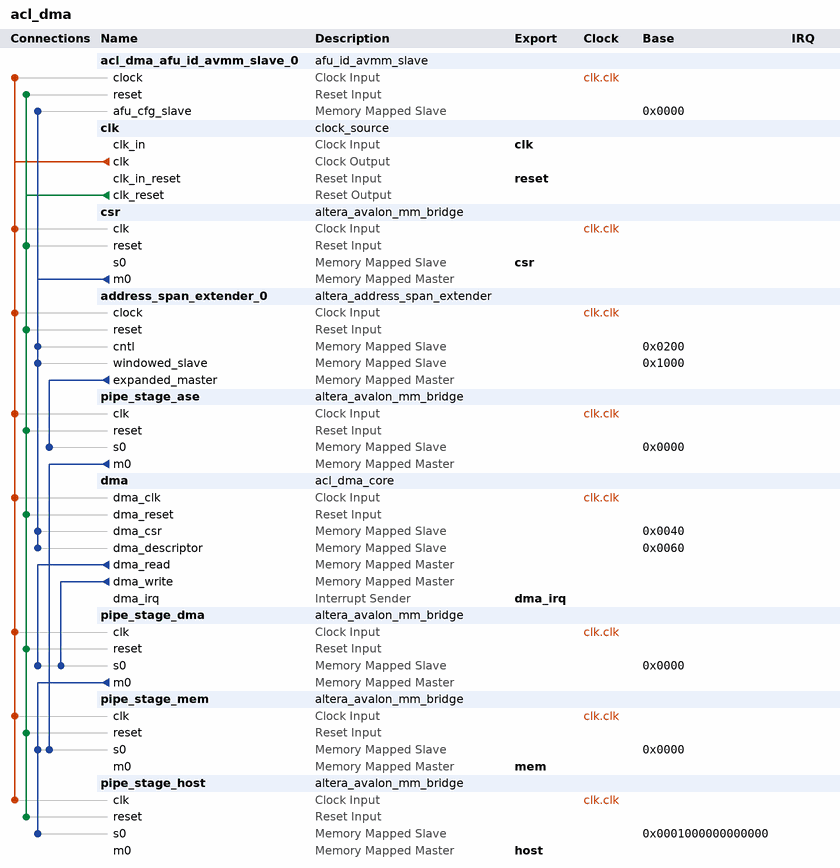
[diagram p0: system contents]
# Platform Designer (Qsys) system acl_dma, Arria 10 10AX115N3F40E2SG
# Parameters at their usual value, and those the tool derives, are not listed.
package require -exact qsys 1.0
create_system acl_dma
set_project_property DEVICE_FAMILY {Arria 10}
set_project_property DEVICE 10AX115N3F40E2SG

add_component acl_dma_afu_id_avmm_slave_0 ip/acl_dma/acl_dma_afu_id_avmm_slave_0.ip afu_id_avmm_slave acl_dma_afu_id_avmm_slave_0 1.0
load_component acl_dma_afu_id_avmm_slave_0
set_component_parameter_value AFU_ID_H 15536303038640245953
set_component_parameter_value AFU_ID_L 10730808499136109731
set_component_parameter_value DFH_FEATURE_TYPE 2
set_component_parameter_value DFH_AFU_MINOR_REV 0
set_component_parameter_value DFH_AFU_MAJOR_REV 0
set_component_parameter_value DFH_END_OF_LIST 1
set_component_parameter_value DFH_NEXT_OFFSET 8192
set_component_parameter_value DFH_FEATURE_ID 0
set_component_parameter_value NEXT_AFU_OFFSET 0
set_component_parameter_value CREATE_SCRATCH_REG 0
save_component

add_component clk ip/acl_dma/acl_dma_clk.ip clock_source clk 
load_component clk
set_component_parameter_value clockFrequency 100000000
set_component_parameter_value resetSynchronousEdges DEASSERT
save_component

add_component csr ip/acl_dma/acl_dma_csr.ip altera_avalon_mm_bridge csr 17.0
load_component csr
set_component_parameter_value DATA_WIDTH 64
set_component_parameter_value ADDRESS_WIDTH 13
set_component_parameter_value USE_AUTO_ADDRESS_WIDTH 0
set_component_parameter_value ADDRESS_UNITS SYMBOLS
set_component_parameter_value MAX_PENDING_RESPONSES 1
save_component

add_component address_span_extender_0 ip/acl_dma/acl_dma_address_span_extender_0.ip altera_address_span_extender address_span_extender_0 17.0
load_component address_span_extender_0
set_component_parameter_value DATA_WIDTH 512
set_component_parameter_value MASTER_ADDRESS_WIDTH 48
set_component_parameter_value SLAVE_ADDRESS_WIDTH 6
set_component_parameter_value BURSTCOUNT_WIDTH 1
set_component_parameter_value MASTER_ADDRESS_DEF 0
set_component_parameter_value ENABLE_SLAVE_PORT true
set_component_parameter_value MAX_PENDING_READS 16
save_component

add_component pipe_stage_ase ip/acl_dma/acl_dma_pipe_stage_0.ip altera_avalon_mm_bridge pipe_stage_ase 17.0
load_component pipe_stage_ase
set_component_parameter_value DATA_WIDTH 512
set_component_parameter_value ADDRESS_WIDTH 48
set_component_parameter_value USE_AUTO_ADDRESS_WIDTH 0
set_component_parameter_value ADDRESS_UNITS SYMBOLS
set_component_parameter_value MAX_PENDING_RESPONSES 16
set_component_parameter_value PIPELINE_COMMAND 0
save_component

add_instance dma acl_dma_core 1.0

add_component pipe_stage_dma ip/acl_dma/acl_dma_pipe_stage_m.ip altera_avalon_mm_bridge pipe_stage_dma 17.0
load_component pipe_stage_dma
set_component_parameter_value DATA_WIDTH 512
set_component_parameter_value ADDRESS_WIDTH 49
set_component_parameter_value USE_AUTO_ADDRESS_WIDTH 0
set_component_parameter_value ADDRESS_UNITS SYMBOLS
set_component_parameter_value MAX_PENDING_RESPONSES 64
save_component

add_component pipe_stage_mem ip/acl_dma/acl_dma_mm_bridge_0.ip altera_avalon_mm_bridge pipe_stage_mem 17.0
load_component pipe_stage_mem
set_component_parameter_value DATA_WIDTH 512
set_component_parameter_value ADDRESS_WIDTH 48
set_component_parameter_value USE_AUTO_ADDRESS_WIDTH 0
set_component_parameter_value ADDRESS_UNITS SYMBOLS
set_component_parameter_value MAX_PENDING_RESPONSES 64
save_component

add_component pipe_stage_host ip/acl_dma/acl_dma_mm_bridge_1.ip altera_avalon_mm_bridge pipe_stage_host 17.0
load_component pipe_stage_host
set_component_parameter_value DATA_WIDTH 512
set_component_parameter_value ADDRESS_WIDTH 48
set_component_parameter_value USE_AUTO_ADDRESS_WIDTH 0
set_component_parameter_value ADDRESS_UNITS SYMBOLS
set_component_parameter_value MAX_PENDING_RESPONSES 64
save_component

# connections
add_connection clk.clk acl_dma_afu_id_avmm_slave_0.clock clock
add_connection clk.clk address_span_extender_0.clock clock
add_connection clk.clk csr.clk clock
add_connection clk.clk dma.dma_clk clock
add_connection clk.clk pipe_stage_ase.clk clock
add_connection clk.clk pipe_stage_dma.clk clock
add_connection clk.clk pipe_stage_host.clk clock
add_connection clk.clk pipe_stage_mem.clk clock
add_connection clk.clk_reset acl_dma_afu_id_avmm_slave_0.reset reset
add_connection clk.clk_reset address_span_extender_0.reset reset
add_connection clk.clk_reset csr.reset reset
add_connection clk.clk_reset dma.dma_reset reset
add_connection clk.clk_reset pipe_stage_ase.reset reset
add_connection clk.clk_reset pipe_stage_dma.reset reset
add_connection clk.clk_reset pipe_stage_host.reset reset
add_connection clk.clk_reset pipe_stage_mem.reset reset
add_connection address_span_extender_0.expanded_master pipe_stage_ase.s0 avalon
set_connection_parameter_value address_span_extender_0.expanded_master/pipe_stage_ase.s0 baseAddress 0x0000
add_connection csr.m0 acl_dma_afu_id_avmm_slave_0.afu_cfg_slave avalon
set_connection_parameter_value csr.m0/acl_dma_afu_id_avmm_slave_0.afu_cfg_slave baseAddress 0x0000
add_connection csr.m0 address_span_extender_0.cntl avalon
set_connection_parameter_value csr.m0/address_span_extender_0.cntl baseAddress 0x0200
add_connection csr.m0 address_span_extender_0.windowed_slave avalon
set_connection_parameter_value csr.m0/address_span_extender_0.windowed_slave baseAddress 0x1000
add_connection csr.m0 dma.dma_csr avalon
set_connection_parameter_value csr.m0/dma.dma_csr baseAddress 0x0040
add_connection csr.m0 dma.dma_descriptor avalon
set_connection_parameter_value csr.m0/dma.dma_descriptor baseAddress 0x0060
add_connection dma.dma_read pipe_stage_dma.s0 avalon
set_connection_parameter_value dma.dma_read/pipe_stage_dma.s0 baseAddress 0x0000
add_connection dma.dma_write pipe_stage_dma.s0 avalon
set_connection_parameter_value dma.dma_write/pipe_stage_dma.s0 baseAddress 0x0000
add_connection pipe_stage_ase.m0 pipe_stage_mem.s0 avalon
set_connection_parameter_value pipe_stage_ase.m0/pipe_stage_mem.s0 baseAddress 0x0000
add_connection pipe_stage_dma.m0 pipe_stage_host.s0 avalon
set_connection_parameter_value pipe_stage_dma.m0/pipe_stage_host.s0 baseAddress 0x0001000000000000
add_connection pipe_stage_dma.m0 pipe_stage_mem.s0 avalon
set_connection_parameter_value pipe_stage_dma.m0/pipe_stage_mem.s0 baseAddress 0x0000

# exported interfaces
add_interface clk clock sink
set_interface_property clk EXPORT_OF clk.clk_in
add_interface csr avalon slave
set_interface_property csr EXPORT_OF csr.s0
add_interface dma_irq interrupt sender
set_interface_property dma_irq EXPORT_OF dma.dma_irq
add_interface host avalon master
set_interface_property host EXPORT_OF pipe_stage_host.m0
add_interface mem avalon master
set_interface_property mem EXPORT_OF pipe_stage_mem.m0
add_interface reset reset sink
set_interface_property reset EXPORT_OF clk.clk_in_reset

set_interconnect_requirement {$system} qsys_mm.clockCrossingAdapter HANDSHAKE
set_interconnect_requirement {$system} qsys_mm.maxAdditionalLatency 0

save_system acl_dma.qsys
